# EAGLE schematic xmega (EAGLE 5.11)
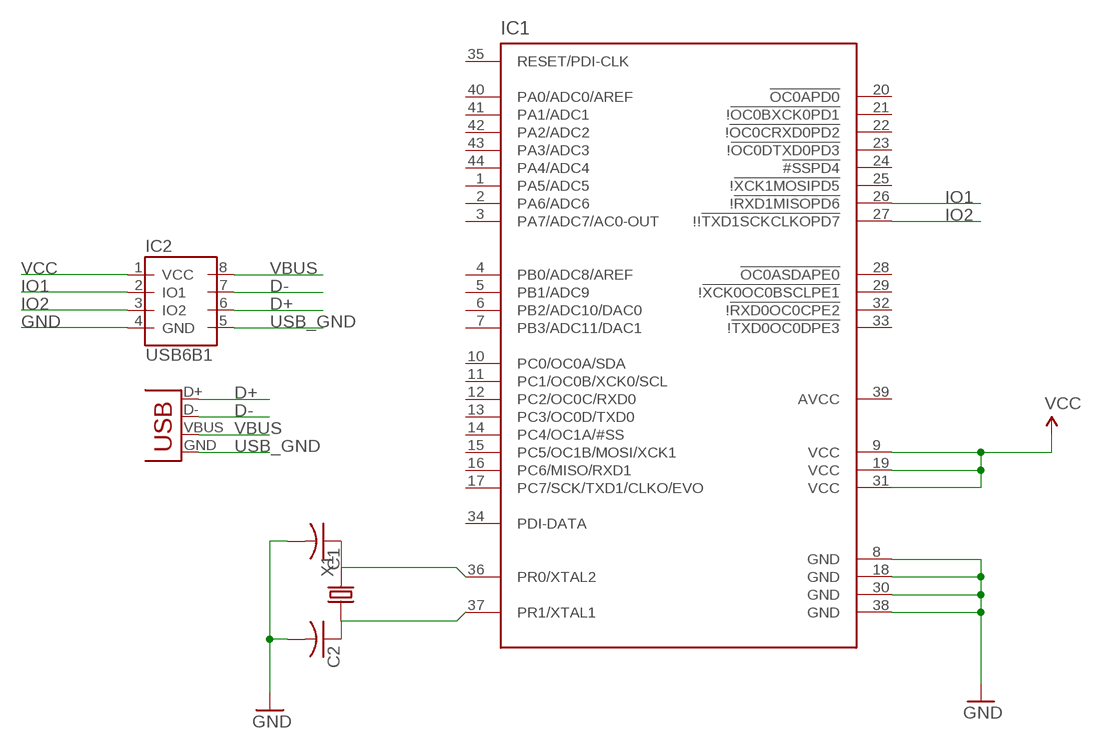
[diagram p0: schematic, sheet 1]

## Parts
C1  C-USC0805  [C0805]
C2  C-USC0805  [C0805]
IC1  AT-XMEGA-XXA4-AU  [QFP80P1200X1200X120-44N]
IC2  USB6B1  [SO08]
USB0  USB-SMD-NS  [USB-MINIB-NOSTOP]
X1  CRYSTAL-5032  [5032]

## Nets
D+: IC2.6(IO2) USB0.D+
D-: IC2.7(IO1) USB0.D-
GND: C1.2 C2.2 IC1.8(GND) IC1.18(GND) IC1.30(GND) IC1.38(GND) IC2.4(GND)
IO1: IC1.26(!!RXD1MISOPD6) IC2.2(IO1)
IO2: IC1.27(!!!TXD1SCKCLKOPD7) IC2.3(IO2)
N$1: C1.1 IC1.36(PR0/XTAL2) X1.2
N$2: C2.1 IC1.37(PR1/XTAL1) X1.1
USB_GND: IC2.5(GND) USB0.GND
VBUS: IC2.8(VCC) USB0.VBUS
VCC: IC1.9(VCC) IC1.19(VCC) IC1.31(VCC) IC2.1(VCC)
Unconnected: IC1.1(PA5/ADC5) IC1.2(PA6/ADC6) IC1.3(PA7/ADC7/AC0-OUT) IC1.4(PB0/ADC8/AREF) IC1.5(PB1/ADC9) IC1.6(PB2/ADC10/DAC0) IC1.7(PB3/ADC11/DAC1) IC1.10(PC0/OC0A/SDA) IC1.11(PC1/OC0B/XCK0/SCL) IC1.12(PC2/OC0C/RXD0) IC1.13(PC3/OC0D/TXD0) IC1.14(PC4/OC1A/#SS) IC1.15(PC5/OC1B/MOSI/XCK1) IC1.16(PC6/MISO/RXD1) IC1.17(PC7/SCK/TXD1/CLKO/EVO) IC1.20(!OC0APD0) IC1.21(!!OC0BXCK0PD1) IC1.22(!!OC0CRXD0PD2) IC1.23(!!OC0DTXD0PD3) IC1.24(!#SSPD4) IC1.25(!!XCK1MOSIPD5) IC1.28(!OC0ASDAPE0) IC1.29(!!XCK0OC0BSCLPE1) IC1.32(!!RXD0OC0CPE2) IC1.33(!!TXD0OC0DPE3) IC1.34(PDI-DATA) IC1.35(RESET/PDI-CLK) IC1.40(PA0/ADC0/AREF) IC1.41(PA1/ADC1) IC1.42(PA2/ADC2) IC1.43(PA3/ADC3) IC1.44(PA4/ADC4)

## Power pins joined to a net without a drawn wire
AVCC: IC1.39(AVCC)

## Library data of the parts
C1 C2 = rcl:C-US: CAPACITOR, American symbol
IC1 = xmega-a4:AT-XMEGA-XXA4-AU: ATxMega a4 Serie
IC2 = st-microelectronics:USB6B1: DATA LINES PROTECTION Source: http://www.st.com/stonline/products/literature/ds/5605.pdf; MPN: USB6B1; OC_FARNELL: 9804358; OC_NEWARK: 26M4750
USB0 = SparkFun:USB: USB Connectors USB-B-PTH is fully proven SKU : PRT-00139 USB-miniB is fully proven SKU : PRT-00587 USB-A-PCB is untested. USB-A-H is throughly reviewed, but untested. Spark Fun Electronics SKU : PRT-00437 USB-B-SMT is throughly reviewed, but untested. Needs silkscreen touching up. USB-A-S has not been used/tested USB-MB-H has not been used/tested
X1 = NSL_MiniQuad:CRYSTAL*: CRYSTAL